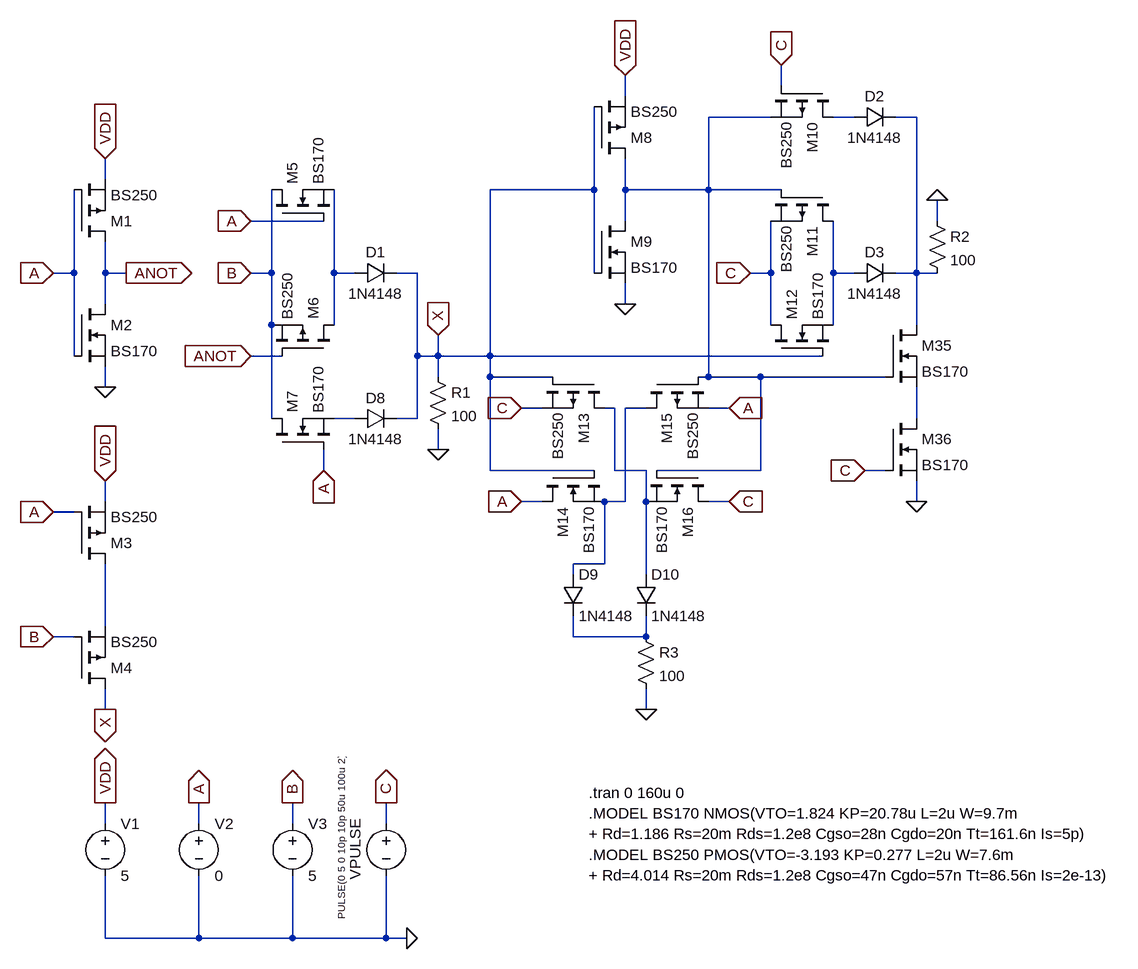
[diagram p0: schematic FullAdderDesign2.asc]
FullAdderDesign2.asc, the LTspice schematic file:
Version 4
SHEET 1 3856 2148
WIRE 1488 816 1488 784
WIRE 1248 832 1248 800
WIRE 1472 864 1376 864
WIRE 1600 864 1568 864
WIRE 1696 864 1664 864
WIRE 448 960 448 928
WIRE 1200 976 1200 848
WIRE 1200 976 1040 976
WIRE 1248 976 1248 928
WIRE 1376 976 1376 864
WIRE 1376 976 1248 976
WIRE 1488 976 1376 976
WIRE 784 1024 672 1024
WIRE 1248 1024 1248 976
WIRE 1728 1024 1728 992
WIRE 400 1104 400 976
WIRE 400 1104 368 1104
WIRE 448 1104 448 1056
WIRE 480 1104 448 1104
WIRE 704 1104 704 976
WIRE 704 1104 672 1104
WIRE 800 1104 800 976
WIRE 832 1104 800 1104
WIRE 928 1104 896 1104
WIRE 1200 1104 1200 976
WIRE 1472 1104 1472 1024
WIRE 1472 1104 1440 1104
WIRE 1568 1104 1568 1024
WIRE 1600 1104 1568 1104
WIRE 1696 1104 1696 864
WIRE 1696 1104 1664 1104
WIRE 1728 1104 1696 1104
WIRE 448 1152 448 1104
WIRE 1248 1152 1248 1120
WIRE 704 1184 704 1104
WIRE 800 1184 800 1104
WIRE 1472 1184 1472 1104
WIRE 1568 1184 1568 1104
WIRE 1696 1184 1696 1104
WIRE 400 1232 400 1104
WIRE 720 1232 672 1232
WIRE 928 1232 928 1104
WIRE 960 1232 960 1200
WIRE 960 1232 928 1232
WIRE 1040 1232 1040 976
WIRE 1040 1232 960 1232
WIRE 1552 1232 1040 1232
WIRE 960 1264 960 1232
WIRE 1040 1264 1040 1232
WIRE 1136 1264 1040 1264
WIRE 1376 1264 1376 976
WIRE 1376 1264 1360 1264
WIRE 1456 1264 1376 1264
WIRE 1648 1264 1456 1264
WIRE 448 1280 448 1248
WIRE 1120 1312 1088 1312
WIRE 1232 1312 1216 1312
WIRE 1280 1312 1248 1312
WIRE 1408 1312 1376 1312
WIRE 704 1328 704 1184
WIRE 832 1328 800 1328
WIRE 928 1328 928 1232
WIRE 928 1328 896 1328
WIRE 1696 1328 1696 1280
WIRE 960 1376 960 1344
WIRE 784 1408 784 1376
WIRE 1040 1408 1040 1264
WIRE 1200 1408 1040 1408
WIRE 1232 1408 1232 1312
WIRE 1280 1408 1232 1408
WIRE 1456 1408 1456 1264
WIRE 1456 1408 1296 1408
WIRE 1648 1408 1616 1408
WIRE 448 1456 448 1424
WIRE 1120 1456 1088 1456
WIRE 1248 1456 1248 1312
WIRE 1248 1456 1216 1456
WIRE 1280 1456 1280 1408
WIRE 1408 1456 1376 1456
WIRE 1696 1456 1696 1424
WIRE 400 1472 368 1472
WIRE 1216 1552 1216 1456
WIRE 1216 1552 1168 1552
WIRE 1168 1568 1168 1552
WIRE 1280 1568 1280 1456
WIRE 448 1648 448 1552
WIRE 400 1664 368 1664
WIRE 1168 1664 1168 1632
WIRE 1280 1664 1280 1632
WIRE 1280 1664 1168 1664
WIRE 448 1776 448 1744
WIRE 1280 1776 1280 1744
WIRE 448 1952 448 1920
WIRE 592 1952 592 1920
WIRE 736 1952 736 1920
WIRE 880 1952 880 1920
WIRE 448 2128 448 2032
WIRE 592 2128 592 2032
WIRE 592 2128 448 2128
WIRE 736 2128 736 2032
WIRE 736 2128 592 2128
WIRE 880 2128 880 2032
WIRE 880 2128 736 2128
WIRE 912 2128 880 2128
FLAG 912 2128 0
FLAG 880 1920 C
IOPIN 880 1920 Out
FLAG 592 1920 A
IOPIN 592 1920 Out
FLAG 736 1920 B
IOPIN 736 1920 Out
FLAG 368 1104 A
IOPIN 368 1104 In
FLAG 448 928 VDD
IOPIN 448 928 In
FLAG 448 1280 0
FLAG 480 1104 ANOT
IOPIN 480 1104 Out
FLAG 672 1232 ANOT
IOPIN 672 1232 In
FLAG 672 1024 A
IOPIN 672 1024 In
FLAG 672 1104 B
IOPIN 672 1104 In
FLAG 784 1408 A
IOPIN 784 1408 In
FLAG 448 1424 VDD
IOPIN 448 1424 In
FLAG 368 1472 A
IOPIN 368 1472 In
FLAG 368 1664 B
IOPIN 368 1664 In
FLAG 448 1776 X
IOPIN 448 1776 Out
FLAG 960 1376 0
FLAG 960 1200 X
IOPIN 960 1200 In
FLAG 1248 800 VDD
IOPIN 1248 800 In
FLAG 1248 1152 0
FLAG 1408 1312 A
IOPIN 1408 1312 In
FLAG 1408 1456 C
IOPIN 1408 1456 In
FLAG 1088 1312 C
IOPIN 1088 1312 In
FLAG 1088 1456 A
IOPIN 1088 1456 In
FLAG 1280 1776 0
FLAG 1440 1104 C
IOPIN 1440 1104 In
FLAG 1488 784 C
IOPIN 1488 784 In
FLAG 1616 1408 C
IOPIN 1616 1408 In
FLAG 1696 1456 0
FLAG 1728 992 0
FLAG 448 1920 VDD
IOPIN 448 1920 Out
SYMBOL voltage 736 1936 R0
SYMATTR InstName V3
SYMATTR Value 5
SYMBOL voltage 880 1936 R0
WINDOW 0 -32 56 VBottom 2
WINDOW 3 -58 40 VBottom 1
WINDOW 123 0 0 Left 0
WINDOW 39 0 0 Left 0
SYMATTR InstName VPULSE
SYMATTR Value PULSE(0 5 0 10p 10p 50u 100u 2)
SYMBOL voltage 592 1936 R0
SYMATTR InstName V2
SYMATTR Value 0
SYMBOL pmos 400 1056 M180
SYMATTR InstName M1
SYMATTR Value BS250
SYMBOL nmos 400 1152 R0
SYMATTR InstName M2
SYMATTR Value BS170
SYMBOL pmos 800 1232 M270
SYMATTR InstName M6
SYMATTR Value BS250
SYMBOL nmos 704 1024 R270
SYMATTR InstName M5
SYMATTR Value BS170
SYMBOL nmos 704 1376 R270
SYMATTR InstName M7
SYMATTR Value BS170
SYMBOL diode 832 1120 R270
WINDOW 0 32 32 VTop 2
WINDOW 3 0 32 VBottom 2
SYMATTR InstName D1
SYMATTR Value 1N4148
SYMBOL diode 832 1344 R270
WINDOW 0 32 32 VTop 2
WINDOW 3 0 32 VBottom 2
SYMATTR InstName D8
SYMATTR Value 1N4148
SYMBOL pmos 400 1552 M180
SYMATTR InstName M3
SYMATTR Value BS250
SYMBOL pmos 400 1744 M180
SYMATTR InstName M4
SYMATTR Value BS250
SYMBOL res 944 1248 R0
SYMATTR InstName R1
SYMATTR Value 100
SYMBOL pmos 1200 928 M180
SYMATTR InstName M8
SYMATTR Value BS250
SYMBOL nmos 1200 1024 R0
SYMATTR InstName M9
SYMATTR Value BS170
SYMBOL pmos 1280 1264 M90
SYMATTR InstName M15
SYMATTR Value BS250
SYMBOL nmos 1376 1408 R90
SYMATTR InstName M16
SYMATTR Value BS170
SYMBOL pmos 1216 1264 R90
SYMATTR InstName M13
SYMATTR Value BS250
SYMBOL nmos 1120 1408 M90
SYMATTR InstName M14
SYMATTR Value BS170
SYMBOL diode 1264 1568 R0
SYMATTR InstName D10
SYMATTR Value 1N4148
SYMBOL res 1264 1648 R0
SYMATTR InstName R3
SYMATTR Value 100
SYMBOL nmos 1472 1232 R270
SYMATTR InstName M12
SYMATTR Value BS170
SYMBOL pmos 1568 976 R90
SYMATTR InstName M11
SYMATTR Value BS250
SYMBOL pmos 1568 816 R90
SYMATTR InstName M10
SYMATTR Value BS250
SYMBOL diode 1600 1120 R270
WINDOW 0 32 32 VTop 2
WINDOW 3 0 32 VBottom 2
SYMATTR InstName D3
SYMATTR Value 1N4148
SYMBOL diode 1600 880 R270
WINDOW 0 32 32 VTop 2
WINDOW 3 0 32 VBottom 2
SYMATTR InstName D2
SYMATTR Value 1N4148
SYMBOL nmos 1648 1184 R0
SYMATTR InstName M35
SYMATTR Value BS170
SYMBOL nmos 1648 1328 R0
SYMATTR InstName M36
SYMATTR Value BS170
SYMBOL res 1712 1008 R0
SYMATTR InstName R2
SYMATTR Value 100
SYMBOL diode 1152 1568 R0
SYMATTR InstName D9
SYMATTR Value 1N4148
SYMBOL voltage 448 1936 R0
SYMATTR InstName V1
SYMATTR Value 5
TEXT 1192 1936 Left 2 !.MODEL BS170 NMOS(VTO=1.824 KP=20.78u L=2u W=9.7m\n+ Rd=1.186 Rs=20m Rds=1.2e8 Cgso=28n Cgdo=20n Tt=161.6n Is=5p)
TEXT 1192 2000 Left 2 !.MODEL BS250 PMOS(VTO=-3.193 KP=0.277 L=2u W=7.6m\n+ Rd=4.014 Rs=20m Rds=1.2e8 Cgso=47n Cgdo=57n Tt=86.56n Is=2e-13)
TEXT 1192 1904 Left 2 !.tran 0 160u 0

The netlist it stands for:
* FullAdderDesign2.asc
V3 B 0 5
VPULSE C 0 PULSE(0 5 0 10p 10p 50u 100u 2)
V2 A 0 0
M1 ANOT A VDD VDD BS250
M2 ANOT A 0 0 BS170
M6 N004 ANOT B B BS250
M5 B A N004 N004 BS170
M7 B A N008 N008 BS170
D1 N004 X 1N4148
D8 N008 X 1N4148
M3 N010 A VDD VDD BS250
M4 X B N010 N010 BS250
R1 X 0 100
M8 N001 X VDD VDD BS250
M9 N001 X 0 0 BS170
M15 N007 N001 A A BS250
M16 C N001 N006 N006 BS170
M13 N006 X C C BS250
M14 A X N007 N007 BS170
D10 N006 N011 1N4148
R3 N011 0 100
M12 C X N005 N005 BS170
M11 N005 N001 C C BS250
M10 N002 C N001 N001 BS250
D3 N005 N003 1N4148
D2 N002 N003 1N4148
M35 N003 N001 N009 N009 BS170
M36 N009 C 0 0 BS170
R2 0 N003 100
D9 N007 N011 1N4148
V1 VDD 0 5
.model D D
.lib standard.dio
.model NMOS NMOS
.model PMOS PMOS
.lib standard.mos
.MODEL BS170 NMOS(VTO=1.824 KP=20.78u L=2u W=9.7m
+ Rd=1.186 Rs=20m Rds=1.2e8 Cgso=28n Cgdo=20n Tt=161.6n Is=5p)
.MODEL BS250 PMOS(VTO=-3.193 KP=0.277 L=2u W=7.6m
+ Rd=4.014 Rs=20m Rds=1.2e8 Cgso=47n Cgdo=57n Tt=86.56n Is=2e-13)
.tran 0 160u 0
.backanno
.end